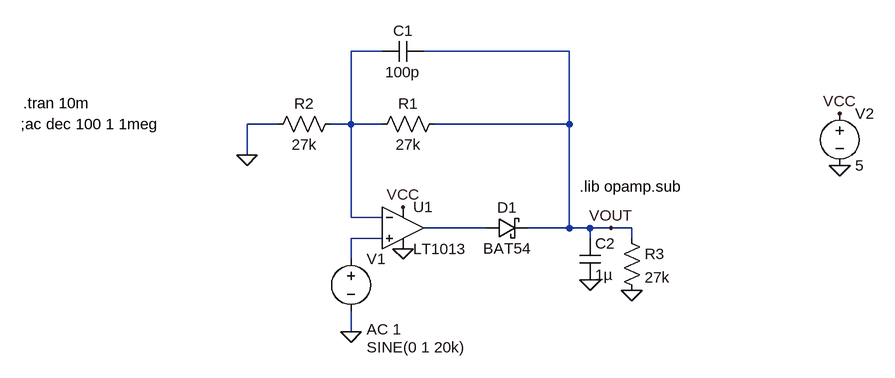
[diagram p0: schematic CurrentSenseAmplifier.asc]
CurrentSenseAmplifier.asc, the LTspice schematic file:
Version 4
SHEET 1 880 680
WIRE 64 -96 16 -96
WIRE 352 -96 128 -96
WIRE -96 16 -144 16
WIRE 16 16 16 -96
WIRE 16 16 -16 16
WIRE 64 16 16 16
WIRE 352 16 352 -96
WIRE 352 16 144 16
WIRE -144 64 -144 16
WIRE 16 160 16 16
WIRE 64 160 16 160
WIRE 224 176 128 176
WIRE 352 176 352 16
WIRE 352 176 288 176
WIRE 384 176 352 176
WIRE 416 176 384 176
WIRE 448 176 416 176
WIRE 64 192 16 192
WIRE 384 192 384 176
WIRE 448 192 448 176
WIRE 16 224 16 192
WIRE 16 336 16 304
FLAG -144 64 0
FLAG 16 336 0
FLAG 448 272 0
FLAG 416 176 VOUT
FLAG 384 256 0
FLAG 96 208 0
FLAG 96 144 VCC
FLAG 768 80 0
FLAG 768 0 VCC
SYMBOL cap 128 -112 R90
WINDOW 0 0 32 VBottom 2
WINDOW 3 32 32 VTop 2
SYMATTR InstName C1
SYMATTR Value 100p
SYMBOL res 160 0 R90
WINDOW 0 0 56 VBottom 2
WINDOW 3 32 56 VTop 2
SYMATTR InstName R1
SYMATTR Value 27k
SYMBOL res 0 0 R90
WINDOW 0 0 56 VBottom 2
WINDOW 3 32 56 VTop 2
SYMATTR InstName R2
SYMATTR Value 27k
SYMBOL voltage 16 208 R0
WINDOW 3 24 152 Left 2
WINDOW 123 24 124 Left 2
WINDOW 39 0 0 Left 0
SYMATTR InstName V1
SYMATTR Value SINE(0 1 20k)
SYMATTR Value2 AC 1
SYMBOL res 432 176 R0
SYMATTR InstName R3
SYMATTR Value 27k
SYMBOL schottky 224 192 R270
WINDOW 0 32 32 VTop 2
WINDOW 3 0 32 VBottom 2
SYMATTR InstName D1
SYMATTR Value BAT54
SYMATTR Description Diode
SYMATTR Type diode
SYMBOL OpAmps\\LT1013 96 112 R0
SYMATTR InstName U1
SYMBOL voltage 768 -16 R0
WINDOW 123 0 0 Left 0
WINDOW 39 0 0 Left 0
SYMATTR InstName V2
SYMATTR Value 5
SYMBOL cap 368 192 R0
SYMATTR InstName C2
SYMATTR Value 1µ
TEXT 368 112 Left 2 !.lib opamp.sub
TEXT -492 16 Left 2 !;ac dec 100 1 1meg
TEXT -488 -16 Left 2 !.tran 10m

The netlist it stands for:
* CurrentSenseAmplifier.asc
C1 VOUT N001 100p
R1 VOUT N001 27k
R2 N001 0 27k
V1 N003 0 SINE(0 1 20k) AC 1
R3 VOUT 0 27k
D1 N002 VOUT BAT54
XU1 N003 N001 VCC 0 N002 LT1013  ; pins In+ In- V+ V- OUT
V2 VCC 0 5
C2 VOUT 0 1µ
.model D D
.lib standard.dio
.lib opamp.sub
;ac dec 100 1 1meg
.tran 10m
.lib LTC.lib
.backanno
.end